# EAGLE design NU-Xtal (EAGLE 5.11)
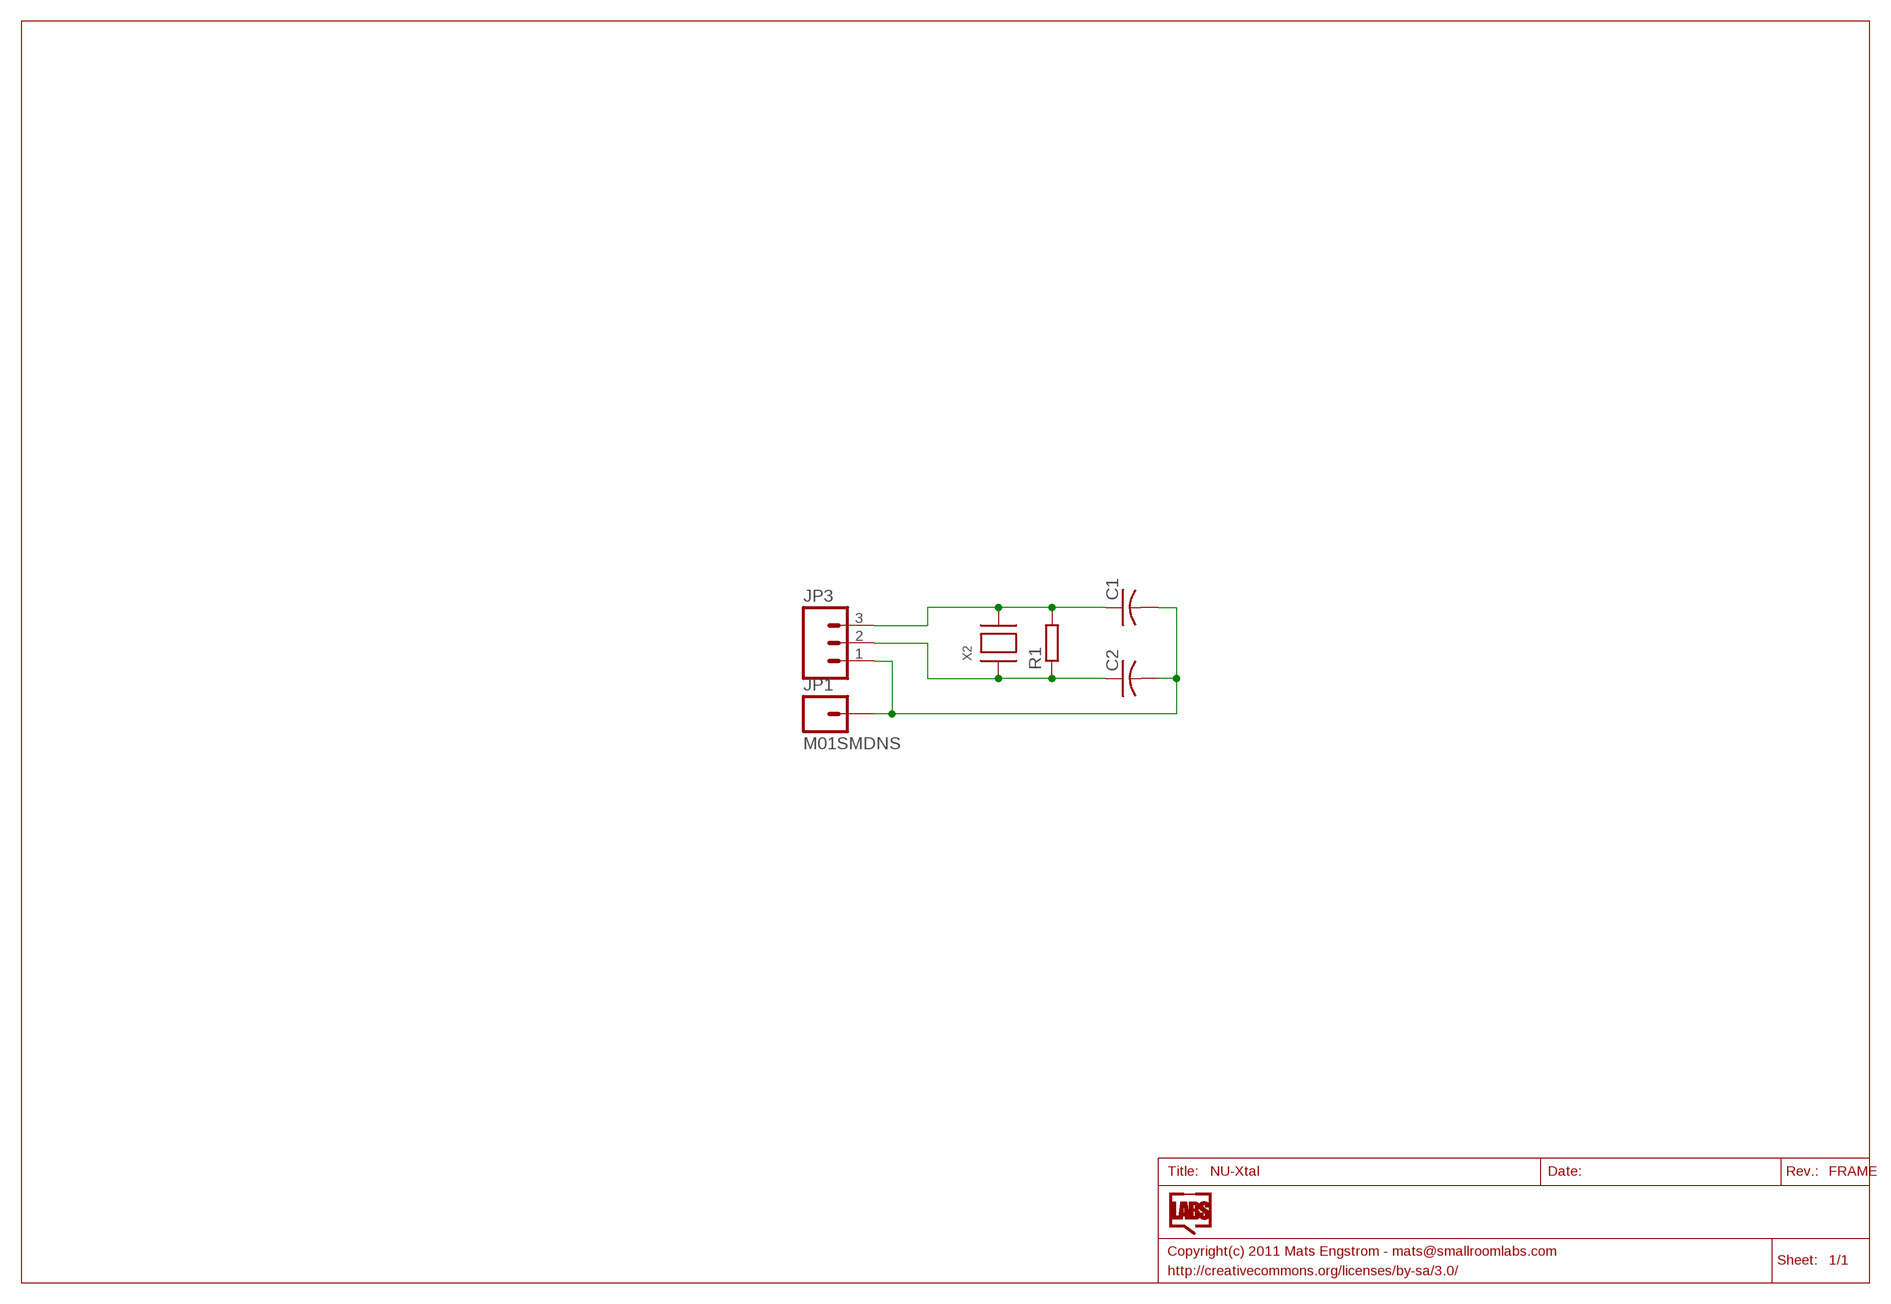
[diagram p0: schematic, sheet 1]

## Parts
C1  C-USC0805  [C0805]
C2  C-USC0805  [C0805]
JP1  M01SMDNS  [1X01NS]
JP3  M031X03_NO_SILK  [1X03_NO_SILK]
R1  R-EU_M0805  [M0805]
X2  XTALNX5032  [NX5032]

## Nets
GND: C1.2 C2.2 JP1.1 JP3.1
N$3: C1.1 JP3.3 R1.2 X2.P$2
N$4: C2.1 JP3.2 R1.1 X2.P$1

## Library data of the parts
C1 C2 = resistor:C-US: CAPACITOR, American symbol
JP1 = SparkFun:M01: Header 1 Standard 1-pin 0.1" header. Use with straight break away headers (SKU : PRT-00116), right angle break away headers (PRT-00553), swiss pins (PRT-00743), machine pins (PRT-00117), and female headers (PRT-00115).
JP3 = SparkFun:M03: Header 3 Standard 3-pin 0.1" header. Use with straight break away headers (SKU : PRT-00116), right angle break away headers (PRT-00553), swiss pins (PRT-00743), machine pins (PRT-00117), and female headers (PRT-00115). Molex polarized connector foot print use with SKU : PRT-08232 with associated crimp pins and housings.
R1 = resistor:R-EU_: RESISTOR, European symbol
X2 = adafruit:XTAL: Low cost SMT crystals, no capacitors included http://www.ladyada.net/library/eagle

## Board
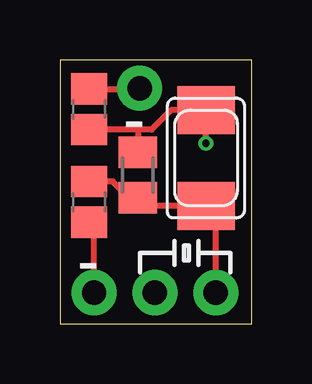
[diagram p1: board, top side]
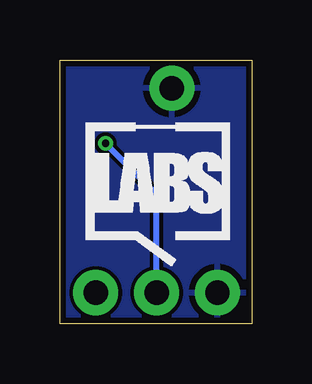
[diagram p2: board, bottom side, seen from below]

Size 8 x 11 mm. Coordinates in mm from the lower left corner, seen from the top.
Outline: 0,0 8,0 8,11 0,11 0,0
Copper layers (1*16): Top 0.035mm / dielectric 1.5mm / Bottom 0.035mm
Design rules "Fusion_eagle_rule_v1.1": minimum track width 6mil, minimum drill 12mil, track to track 6mil, track to pad 6mil, pad to pad 6mil, via to via 6mil, smd to smd 0mil, copper to edge 10mil, drill to drill 10mil, minimum pad ring 10mil, minimum via ring 6mil, stop-mask expansion 2mil, vias tented up to drill 100mil, thermal gap 10mil

### Footprints (pad centres in the part's own frame; a part is rotated, then mirrored left to right if it is on the bottom)
C0805 = smd 1.3 x 1.5: 1 -0.85,0; 2 0.85,0
1X01NS = drill 1.016 pad 1.88 round: 1 0,0
1X03_NO_SILK = drill 1.016 pad 1.88 round: 1 0,0; 2 2.54,0; 3 5.08,0
M0805 = smd 1.3 x 1.6: 1 -0.95,0; 2 0.95,0
NX5032 = smd 2 x 2.4: P$1 2,0; P$2 -2,0

### Placement (x,y rotation side)
C1  1.22,5.08 270 top
C2  1.22,8.94 90 top
JP1  3.33,9.82 0 top
JP3  1.42,1.29 0 top
R1  3.25,6.2 270 top
U$1  [SRL-LOGO-BSILK-5MM]  6.91,3.66 0 top
X2  6.1,6.91 90 top

### Tracks (layer width: path | path; a pad name or v marks a point on that pad's centre or on a via)
GND
  Top 0.254: C2.2 3.3,9.79 JP1.1 | JP3.1 1.43,4.02 C1.2
  pour Bottom: 0,0 8,0 8,11 0,11
N$3
  Top 0.254: JP3.3 6.5,4.5 X2.P$2 3.59,4.91 R1.2 3.01,5.49 2.64,5.49 2.2,5.93 C1.1
N$4  (via drill 0.3)
  Top 0.254: v6.1,7.52 X2.P$1 4.64,8.91 3.82,8.09 3.25,8.09 | 3.25,8.09 C2.1 | 3.25,8.09 R1.1
  Bottom 0.254: JP3.2 3.96,5.39 v6.1,7.52

### Text on the board
tPlace: - | -